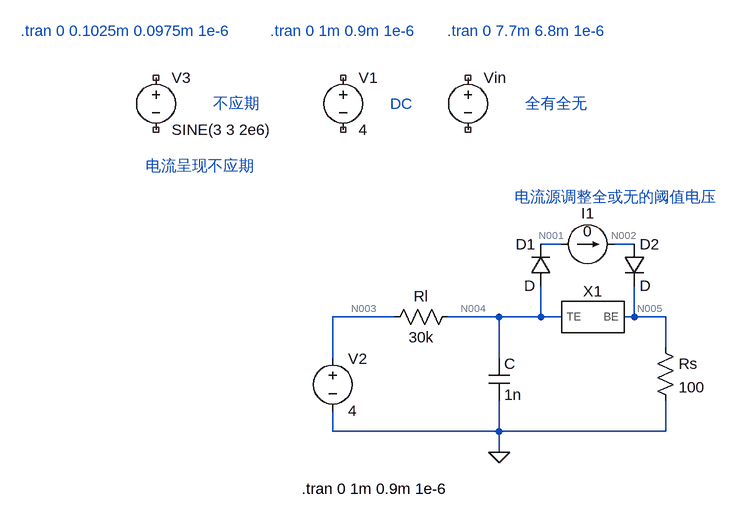
[diagram p0: schematic 神经元电路.asc]
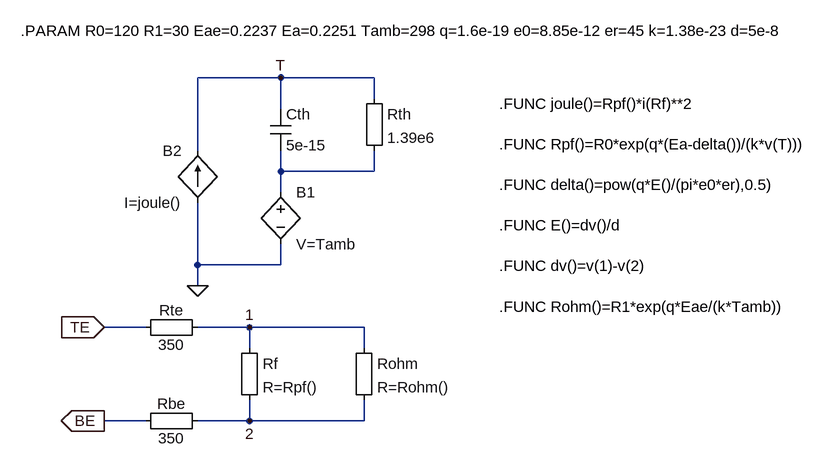
[diagram p1: sub-circuit 神经元拟合.asc]
* 神经元电路.asc
Vin NC_01 NC_02 PWL(6.99999e-3 0 7e-3 2 7.02e-3 2 7.02001e-3 0 7.1e-3 0 7.10001e-3 2.2 7.12e-3 2.2 7.12001e-3 0 7.2e-3 0 7.20001e-3 2.4 7.22e-3 2.4 7.22001e-3 0 7.3e-3 0 7.3001e-3 2.6 7.32e-3 2.6 7.32001e-3 0 7.4e-3 0 7.40001e-3 2.8 7.42e-3 2.8 7.42001e-3 0 7.5e-3 0 7.50001e-3 3 7.52e-3 3 7.52001e-3 0 7.6e-3 0 7.60001e-3 3.2 7.62e-3 3.2 7.62001e-3 0)
Rl N004 N003 30k
C N004 0 1n
XX1 N004 N005 神经元拟合
Rs N005 0 100
V1 NC_03 NC_04 4
V3 NC_05 NC_06 SINE(3 3 2e6)
D1 N004 N001 D
D2 N002 N005 D
I1 N001 N002 0
V2 N003 0 4

* block symbol definitions
.subckt 神经元拟合 TE BE
Cth T N001 5e-15
Rth T N001 1.39e6
Rf 1 2 R=Rpf()
Rohm 1 2 R=Rohm()
Rte 1 TE 350
Rbe 2 BE 350
B1 N001 0 V=Tamb
B2 0 T I=joule()
.FUNC joule()=Rpf()*i(Rf)**2
.FUNC Rpf()=R0*exp(q*(Ea-delta())/(k*v(T)))
.FUNC delta()=pow(q*E()/(pi*e0*er),0.5)
.FUNC E()=dv()/d
.FUNC dv()=v(1)-v(2)
.FUNC Rohm()=R1*exp(q*Eae/(k*Tamb))
.PARAM R0=120 R1=30 Eae=0.2237 Ea=0.2251 Tamb=298 q=1.6e-19 e0=8.85e-12 er=45 k=1.38e-23 d=5e-8
.ends 神经元拟合

.model D D
.lib standard.dio
* DC
* 全有全无
* 不应期
* 电流源调整全或无的阈值电压
* 电流呈现不应期
* .tran 0 7.7m 6.8m 1e-6
* .tran 0 0.1025m 0.0975m 1e-6
.tran 0 1m 0.9m 1e-6
* .tran 0 1m 0.9m 1e-6
.backanno
.end

* Results of the author's LTspice run, read from the files saved beside the schematic
* Operating Point, zero values left out:
*   V(n004) = 1.163 V
*   V(n003) = 4 V
*   V(n005) = 9.457 mV
*   V(n001) = 1.163 V
*   V(n002) = 9.457 mV
*   I(Rl) = -94.57 µA
*   I(Rs) = 94.57 µA
*   I(V2) = -94.57 µA
*   Ix(x1:TE) = 94.57 µA
*   Ix(x1:BE) = -94.57 µA
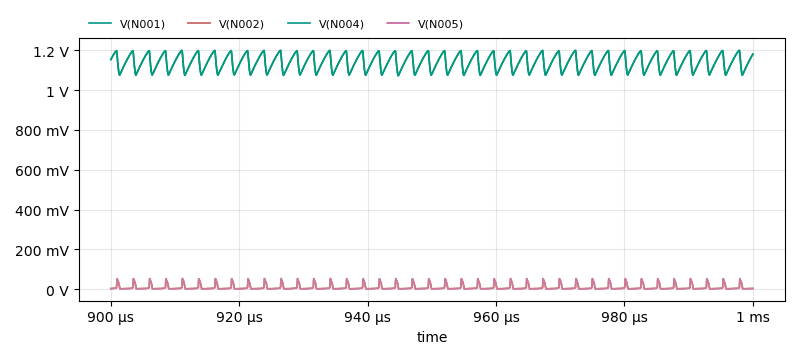
[diagram p2: Transient Analysis of 神经元电路.asc, plotted from the saved traces]
* Transient Analysis, 1 run:
*   V(N001): min 1.072 V, max 1.199 V, average 1.14 V, rms 1.14 V, last 1.18 V
*   V(N002): min 2.426 mV, max 53.62 mV, average 9.504 mV, rms 16.55 mV, last 4.155 mV
*   V(N004): min 1.072 V, max 1.199 V, average 1.14 V, rms 1.14 V, last 1.18 V
*   V(N005): min 2.426 mV, max 53.62 mV, average 9.504 mV, rms 16.55 mV, last 4.155 mV